# EAGLE design esp32_servo_lcd_cam (EAGLE 9.7.0)
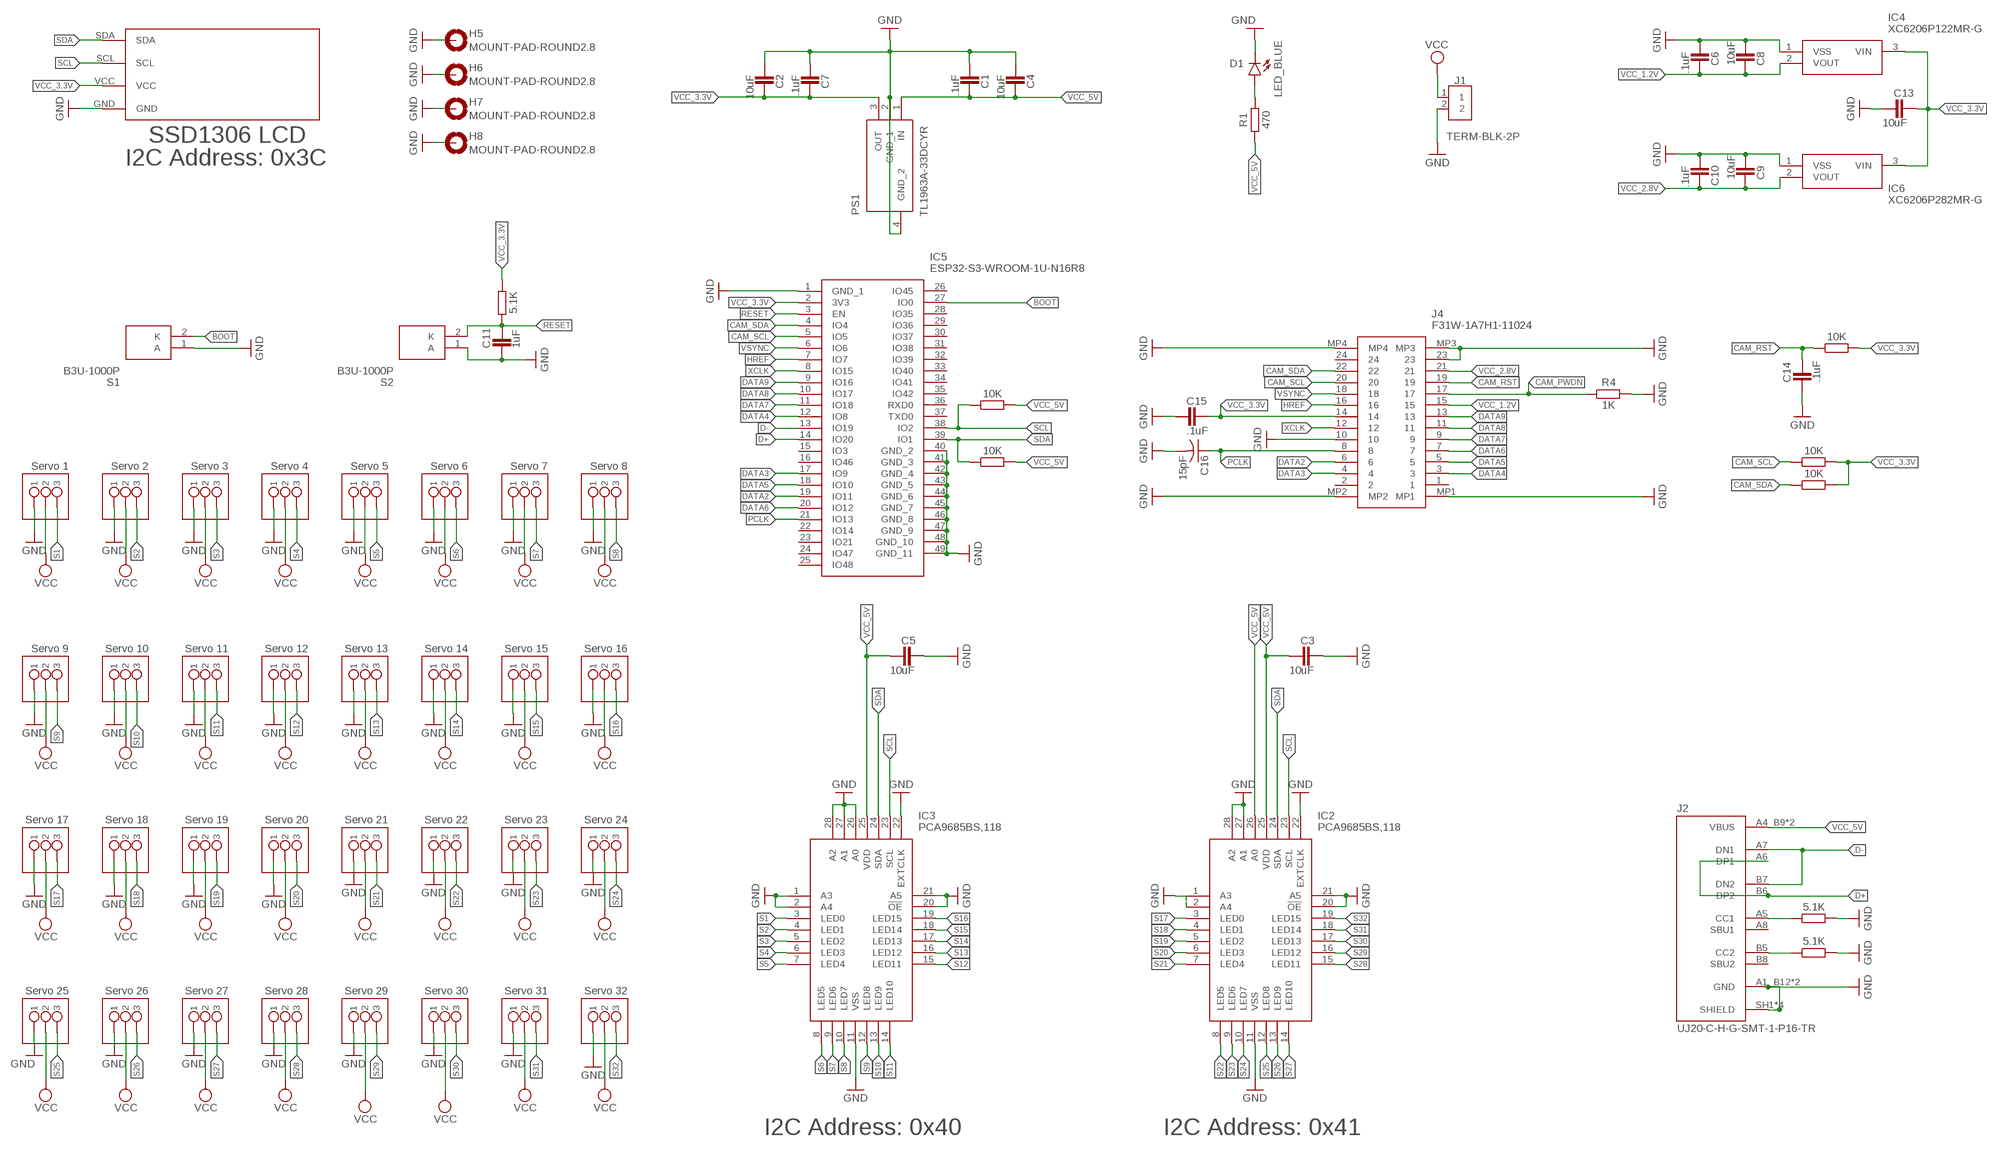
[diagram p0: schematic, sheet 1]

## Parts
C1  .1uF  CAPACITOR_CHIP-0504(1310-METRIC)  [CAPC1110X102]
C2  10uF  CAPACITOR_CHIP-0504(1310-METRIC)  [CAPC1110X102]
C3  10uF  CAPACITOR_CHIP-0504(1310-METRIC)  [CAPC1110X102]
C4  10uF  CAPACITOR_CHIP-0504(1310-METRIC)  [CAPC1110X102]
C5  10uF  CAPACITOR_CHIP-0504(1310-METRIC)  [CAPC1110X102]
C6  .1uF  CAPACITOR_CHIP-0504(1310-METRIC)  [CAPC1110X102]
C7  .1uF  CAPACITOR_CHIP-0504(1310-METRIC)  [CAPC1110X102]
C8  10uF  CAPACITOR_CHIP-0504(1310-METRIC)  [CAPC1110X102]
C9  10uF  CAPACITOR_CHIP-0504(1310-METRIC)  [CAPC1110X102]
C10  .1uF  CAPACITOR_CHIP-0504(1310-METRIC)  [CAPC1110X102]
C11  1uF  CAPACITOR_CHIP-0504(1310-METRIC)  [CAPC1110X102]
C13  10uF  CAPACITOR_CHIP-0504(1310-METRIC)  [CAPC1110X102]
C14  .1uF  CAPACITOR_CHIP-0504(1310-METRIC)  [CAPC1110X102]
C15  .1uF  CAPACITOR_CHIP-0504(1310-METRIC)  [CAPC1110X102]
C16  15pF  C-US_CHIP-0805(2012-METRIC)  [CAPC2012X110]
D1  LED_BLUE  CHIP-FLAT-B_0603-0.80MM  [LEDC1608X80N_FLAT-B]
H5  MOUNT-PAD-ROUND2.8  [2,8-PAD]
H6  MOUNT-PAD-ROUND2.8  [2,8-PAD]
H7  MOUNT-PAD-ROUND2.8  [2,8-PAD]
H8  MOUNT-PAD-ROUND2.8  [2,8-PAD]
IC2  PCA9685BS,118  [QFN65P600X600X100-29N]
IC3  PCA9685BS,118  [QFN65P600X600X100-29N]
IC4  XC6206P122MR-G  [SOT95P280X130-3N]
IC5  ESP32-S3-WROOM-1U-N16R8  [ESP32S3WROOM1UN16R8]
IC6  XC6206P282MR-G  [SOT95P280X130-3N]
J1  TERM-BLK-2P  2828XX-2282837-2  [TERMBLK_508-2N]
J2  UJ20-C-H-G-SMT-1-P16-TR  [SAMESKY_UJ20-C-H-G-SMT-1-P16-TR]
J4  F31W-1A7H1-11024  [F31W1A7H111024]
PS1  TL1963A-33DCYR  [SOT230P700X180-4N]
R1  470  R_CHIP-0402(1005-METRIC)  [RESC1005X40]
R2  5.1K  R_CHIP-0402(1005-METRIC)  [RESC1005X40]
R3  10K  R_CHIP-0402(1005-METRIC)  [RESC1005X40]
R4  1K  R_CHIP-0603(1608-METRIC)  [RESC1608X60]
R5  10K  R_CHIP-0402(1005-METRIC)  [RESC1005X40]
R6  10K  R_CHIP-0402(1005-METRIC)  [RESC1005X40]
R11  5.1K  R_CHIP-0402(1005-METRIC)  [RESC1005X40]
R12  5.1K  R_CHIP-0402(1005-METRIC)  [RESC1005X40]
R23  10K  R_CHIP-0402(1005-METRIC)  [RESC1005X40]
R24  10K  R_CHIP-0402(1005-METRIC)  [RESC1005X40]
S1  B3U-1000P  [B3U-1000P]
S2  B3U-1000P  [B3U-1000P]
U$1  Servo 6  PINHD-1X03_1X03M  [1X03]
U$2  Servo 7  PINHD-1X03_1X03M  [1X03]
U$3  Servo 8  PINHD-1X03_1X03M  [1X03]
U$4  Servo 9  PINHD-1X03_1X03M  [1X03]
U$5  Servo 10  PINHD-1X03_1X03M  [1X03]
U$6  Servo 11  PINHD-1X03_1X03M  [1X03]
U$7  Servo 12  PINHD-1X03_1X03M  [1X03]
U$8  Servo 13  PINHD-1X03_1X03M  [1X03]
U$9  Servo 14  PINHD-1X03_1X03M  [1X03]
U$10  Servo 15  PINHD-1X03_1X03M  [1X03]
U$11  Servo 4  PINHD-1X03_1X03M  [1X03]
U$12  Servo 5  PINHD-1X03_1X03M  [1X03]
U$13  Servo 1  PINHD-1X03_1X03M  [1X03]
U$14  Servo 3  PINHD-1X03_1X03M  [1X03]
U$15  Servo 2  PINHD-1X03_1X03M  [1X03]
U$16  Servo 16  PINHD-1X03_1X03M  [1X03]
U$17  Servo 17  PINHD-1X03_1X03M  [1X03]
U$18  Servo 18  PINHD-1X03_1X03M  [1X03]
U$19  Servo 19  PINHD-1X03_1X03M  [1X03]
U$20  Servo 21  PINHD-1X03_1X03M  [1X03]
U$21  Servo 20  PINHD-1X03_1X03M  [1X03]
U$22  Servo 22  PINHD-1X03_1X03M  [1X03]
U$23  Servo 23  PINHD-1X03_1X03M  [1X03]
U$24  Servo 24  PINHD-1X03_1X03M  [1X03]
U$25  Servo 25  PINHD-1X03_1X03M  [1X03]
U$26  Servo 26  PINHD-1X03_1X03M  [1X03]
U$27  Servo 27  PINHD-1X03_1X03M  [1X03]
U$28  Servo 28  PINHD-1X03_1X03M  [1X03]
U$29  Servo 29  PINHD-1X03_1X03M  [1X03]
U$30  Servo 30  PINHD-1X03_1X03M  [1X03]
U$31  Servo 31  PINHD-1X03_1X03M  [1X03]
U$32  Servo 32  PINHD-1X03_1X03M  [1X03]
U$33  128X32_SSD1306_I2C_LCD  [128X32_SSD1306_I2C_LCD_]

## Nets
BOOT: IC5.27(IO0) S1.2(K)
CAM_PWDN: J4.17 R4.1
CAM_RST: C14.1 J4.19 R3.1
CAM_SCL: IC5.5(IO5) J4.20 R5.1
CAM_SDA: IC5.4(IO4) J4.22 R6.1
D+: IC5.14(IO20) J2.A6(DP1) J2.B6(DP2)
D-: IC5.13(IO19) J2.A7(DN1) J2.B7(DN2)
DATA2: IC5.19(IO11) J4.6
DATA3: IC5.17(IO9) J4.4
DATA4: IC5.12(IO8) J4.3
DATA5: IC5.18(IO10) J4.5
DATA6: IC5.20(IO12) J4.7
DATA7: IC5.11(IO18) J4.9
DATA8: IC5.10(IO17) J4.11
DATA9: IC5.9(IO16) J4.13
GND: C1.2 C2.2 C3.1 C4.2 C5.1 C6.2 C7.2 C8.2 C9.2 C10.2 C11.2 C13.2 C14.2 C15.2 C16.2 D1.C H5.B2,8(MOUNT) H6.B2,8(MOUNT) H7.B2,8(MOUNT) H8.B2,8(MOUNT) IC2.11(VSS) IC2.20(!OE) IC2.21(A5) IC2.27(A1) IC2.28(A2) IC3.1(A3) IC3.2(A4) IC3.11(VSS) IC3.20(!OE) IC3.21(A5) IC3.22(EXTCLK) IC3.26(A0) IC3.27(A1) IC3.28(A2) IC4.1(VSS) IC5.1(GND_1) IC5.40(GND_2) IC5.41(GND_3) IC5.42(GND_4) IC5.43(GND_5) IC5.44(GND_6) IC5.45(GND_7) IC5.46(GND_8) IC5.47(GND_9) IC5.48(GND_10) IC5.49(GND_11) IC6.1(VSS) J1.2 J2.A1_B12(GND) J2.B1_A12(GND) J2.SH1(SHIELD) J2.SH2(SHIELD) J2.SH3(SHIELD) J2.SH4(SHIELD) J4.10 J4.23 J4.MP1 J4.MP2 J4.MP3 J4.MP4 PS1.2(GND_1) PS1.4(GND_2) R4.2 R11.2 R12.2 S1.1(A) S2.1(A) U$1.1 U$2.1 U$3.1 U$4.1 U$5.1 U$6.1 U$7.1 U$8.1 U$9.1 U$10.1 U$11.1 U$12.1 U$13.1 U$14.1 U$15.1 U$16.1 U$17.1 U$18.1 U$19.1 U$20.1 U$21.1 U$22.1 U$23.1 U$24.1 U$25.1 U$26.1 U$27.1 U$28.1 U$29.1 U$30.1 U$31.1 U$32.1 U$33.GND
HREF: IC5.7(IO7) J4.16
N$1: D1.A R1.2
N$2: J2.A5(CC1) R12.1
N$3: J2.B5(CC2) R11.1
N$4: IC2.2(A4)
N$5: IC2.22(EXTCLK) ; supply symbol labelled GND
N$7: IC2.1(A3) ; supply symbol labelled GND
PCLK: C16.1 IC5.21(IO13) J4.8
RESET: C11.1 IC5.3(EN) R2.2 S2.2(K)
S1: IC3.3(LED0) U$13.3
S2: IC3.4(LED1) U$15.3
S3: IC3.5(LED2) U$14.3
S4: IC3.6(LED3) U$11.3
S5: IC3.7(LED4) U$12.3
S6: IC3.8(LED5) U$1.3
S7: IC3.9(LED6) U$2.3
S8: IC3.10(LED7) U$3.3
S9: IC3.12(LED8) U$4.3
S10: IC3.13(LED9) U$5.3
S11: IC3.14(LED10) U$6.3
S12: IC3.15(LED11) U$7.3
S13: IC3.16(LED12) U$8.3
S14: IC3.17(LED13) U$9.3
S15: IC3.18(LED14) U$10.3
S16: IC3.19(LED15) U$16.3
S17: IC2.3(LED0) U$17.3
S18: IC2.4(LED1) U$18.3
S19: IC2.5(LED2) U$19.3
S20: IC2.6(LED3) U$21.3
S21: IC2.7(LED4) U$20.3
S22: IC2.8(LED5) U$22.3
S23: IC2.9(LED6) U$23.3
S24: IC2.10(LED7) U$24.3
S25: IC2.12(LED8) U$25.3
S26: IC2.13(LED9) U$26.3
S27: IC2.14(LED10) U$27.3
S28: IC2.15(LED11) U$28.3
S29: IC2.16(LED12) U$29.3
S30: IC2.17(LED13) U$30.3
S31: IC2.18(LED14) U$31.3
S32: IC2.19(LED15) U$32.3
SCL: IC2.23(SCL) IC3.23(SCL) IC5.38(IO2) R23.1 U$33.SCL
SDA: IC2.24(SDA) IC3.24(SDA) IC5.39(IO1) R24.1 U$33.SDA
VCC: J1.1 U$1.2 U$2.2 U$3.2 U$4.2 U$5.2 U$6.2 U$7.2 U$8.2 U$9.2 U$10.2 U$11.2 U$12.2 U$13.2 U$14.2 U$15.2 U$16.2 U$17.2 U$18.2 U$19.2 U$20.2 U$21.2 U$22.2 U$23.2 U$24.2 U$25.2 U$26.2 U$27.2 U$28.2 U$29.2 U$30.2 U$31.2 U$32.2
VCC_1.2V: C6.1 C8.1 IC4.2(VOUT) J4.15
VCC_2.8V: C9.1 C10.1 IC6.2(VOUT) J4.21
VCC_3.3V: C2.1 C7.1 C13.1 C15.1 IC4.3(VIN) IC5.2(3V3) IC6.3(VIN) J4.14 PS1.3(OUT) R2.1 R3.2 R5.2 R6.2 U$33.VCC
VCC_5V: C1.1 C3.2 C4.1 C5.2 IC2.25(VDD) IC2.26(A0) IC3.25(VDD) J2.A4_B9(VBUS) J2.B4_A9(VBUS) PS1.1(IN) R1.1 R23.2 R24.2
VSYNC: IC5.6(IO6) J4.18
XCLK: IC5.8(IO15) J4.12
Unconnected: IC5.15(IO3) IC5.16(IO46) IC5.22(IO14) IC5.23(IO21) IC5.24(IO47) IC5.25(IO48) IC5.26(IO45) IC5.28(IO35) IC5.29(IO36) IC5.30(IO37) IC5.31(IO38) IC5.32(IO39) IC5.33(IO40) IC5.34(IO41) IC5.35(IO42) IC5.36(RXD0) IC5.37(TXD0) J2.A8(SBU1) J2.B8(SBU2) J4.1 J4.2 J4.24

## Notes on the sheet
- SSD1306 LCD
- I2C Address: 0x3C
- I2C Address: 0x40 | I2C Address: 0x41

## Library data of the parts
C1-C11 C13-C15 = Tinkercad:CAPACITOR: Capacitor - Generic; CATEGORY: Capacitor
C16 = Capacitor:C-US: Capacitor - ANSI; CATEGORY: Capacitor
D1 = LED:CHIP-FLAT-B; CATEGORY: LED; COLOR: BLUE; DESCRIPTION: CHIP LED FLAT; SUB-CATEGORY: CHIP; TYPE: FLAT_TOP
H5-H8 = holes:MOUNT-PAD-ROUND: MOUNTING PAD, round
IC2 IC3 = PCA9685BS_118:PCA9685BS,118: NXP - PCA9685BS,118 - LED Driver, 16 Bit, I2C Bus, 12-bit PWM 24 Hz to 1526 Hz, RGBA color, 2.3 V to 5.5 V in, HVQFN-28 Source: Datasheet <http://www.nxp.com/docs/en/data-sheet/PCA9685.pdf>; DESCRIPTION: NXP - PCA9685BS,118 - LED Driver, 16 Bit, I2C Bus, 12-bit PWM 24 Hz to 1526 Hz, RGBA color, 2.3 V to 5.5 V in, HVQFN-28; HEIGHT: 1mm; MANUFACTURER_NAME: NXP; MANUFACTURER_PART_NUMBER: PCA9685BS,118; MOUSER_PART_NUMBER: 771-PCA9685BS118; MOUSER_PRICE-STOCK: https://www.mouser.co.uk/ProductDetail/NXP-Semiconductors/PCA9685BS118?qs=beN0Cyoe8Yle51zseU5uxw%3D%3D
IC4 = XC6206P122MR-G:XC6206P122MR-G: LDO Voltage Regulators 1uA Low Quiescent 3 Terminal, Low ESR Cap. Compatible, Voltage Regulator Source: Datasheet <https://www.torexsemi.com/file/xc6206/XC6206.pdf>; DESCRIPTION: LDO Voltage Regulators 1uA Low Quiescent 3 Terminal, Low ESR Cap. Compatible, Voltage Regulator; HEIGHT: 1.3mm; MANUFACTURER_NAME: Torex; MANUFACTURER_PART_NUMBER: XC6206P122MR-G; MOUSER_PART_NUMBER: 865-XC6206P122MR-G; MOUSER_PRICE-STOCK: https://www.mouser.co.uk/ProductDetail/Torex-Semiconductor/XC6206P122MR-G?qs=AsjdqWjXhJ%2F35%2FU%2FZk2JYg%3D%3D
IC5 = ESP32-S3-WROOM-1U-N16R8:ESP32-S3-WROOM-1U-N16R8: WiFi Modules - 802.11 [Engineering Samples] SMD Module, ESP32-S3R8, 8 MB Octal PSRAM Die, 16 MB Quad SPI Flash, IPEX Antenna Connector Source: Datasheet <https://www.espressif.com/sites/default/files/documentation/esp32-s3-wroom-1_wroom-1u_datasheet_en.pdf>; DESCRIPTION: WiFi Modules - 802.11 [Engineering Samples] SMD Module, ESP32-S3R8, 8 MB Octal PSRAM Die, 16 MB Quad SPI Flash, IPEX Antenna Connector; HEIGHT: 3.35mm; MANUFACTURER_NAME: Espressif Systems; MANUFACTURER_PART_NUMBER: ESP32-S3-WROOM-1U-N16R8; MOUSER_PART_NUMBER: 356-ESP32S3WM1UN16R8; MOUSER_PRICE-STOCK: https://www.mouser.co.uk/ProductDetail/Espressif-Systems/ESP32-S3-WROOM-1U-N16R8?qs=Li%252BoUPsLEns6V0Pr5KRJtw%3D%3D
IC6 = XC6206P282MR-G:XC6206P282MR-G: LDO Voltage Regulators 1uA Low Quiescent 3 Terminal, Low ESR Cap. Compatible, Voltage Regulator Source: Datasheet <https://www.torexsemi.com/file/xc6206/XC6206.pdf>; DESCRIPTION: LDO Voltage Regulators 1uA Low Quiescent 3 Terminal, Low ESR Cap. Compatible, Voltage Regulator; HEIGHT: 1.3mm; MANUFACTURER_NAME: Torex; MANUFACTURER_PART_NUMBER: XC6206P282MR-G; MOUSER_PART_NUMBER: 865-XC6206P282MR-G; MOUSER_PRICE-STOCK: https://www.mouser.co.uk/ProductDetail/Torex-Semiconductor/XC6206P282MR-G?qs=AsjdqWjXhJ%2Fpd3DOBopSeA%3D%3D
J1 = Connector:2828XX-2: 2 Position Wire to Board Terminal Block Horizontal with Board Datasheet <https://www.te.com.cn/commerce/DocumentDelivery/DDEController?Action=showdoc&DocId=Catalog+Section%7F1308389_EUROSTYLE_TERMINAL_BLOCKS%7F0607%7Fpdf%7FEnglish%7FENG_CS_1308389_EUROSTYLE_TERMINAL_BLOCKS_0607.pdf%7F2-282837-5>; CATEGORY: Fixed Terminal Blocks; DESCRIPTION: Fixed Terminal Blocks 5.08MM PCB MOUNT 2P; MANUFACTURER: TE Connectivity AMP Connectors; MPN: 282837-2; OPERATING_TEMPERATURE: -40°C to +105°C; PART_STATUS: ACTIVE; PITCH: 0.200" (5.08mm); ROHS_COMPLIANCE: RoHS Compliant; SERIES: Buchanan; SUBCATEGORY: Terminal Blocks; TYPE: Through Hole; Screw - Rising Cage Clamp; Side wire entry, Horizontal with Board
J2 = UJ20-C-H-G-SMT-1-P16-TR:UJ20-C-H-G-SMT-1-P16-TR; MANUFACTURER: Same Sky; MAXIMUM_PACKAGE_HEIGHT: 3.46mm; PARTREV: 1.0; STANDARD: Manufacturer Recommendations
J4 = F31W-1A7H1-11024:F31W-1A7H1-11024: Flex Connector, 0.50mm Pitch, Height 4.25mm, Vertical, Slider type, ZIF, 24 position, Without MYLAR Source: Datasheet <https://cdn.amphenol-cs.com/media/wysiwyg/files/documentation/datasheet/flex/ffc_fpc_050mm_f31w_f31z_f314_f336.pdf>; DESCRIPTION: Flex Connector, 0.50mm Pitch, Height 4.25mm, Vertical, Slider type, ZIF, 24 position, Without MYLAR; HEIGHT: 4.45mm; MANUFACTURER_NAME: Amphenol; MANUFACTURER_PART_NUMBER: F31W-1A7H1-11024; MOUSER_PART_NUMBER: 649-F31W-1A7H1-11024; MOUSER_PRICE-STOCK: https://www.mouser.co.uk/ProductDetail/Amphenol-Aorora/F31W-1A7H1-11024?qs=xZ%2FP%252Ba9zWqa0iq%252BjDeduug%3D%3D
PS1 = TL1963A-33DCYR:TL1963A-33DCYR: 1.5-A Low-Noise Fast-Transient-Response Low-Dropout Regulator Source: Datasheet <http://www.ti.com/lit/gpn/tl1963a>; DESCRIPTION: 1.5-A Low-Noise Fast-Transient-Response Low-Dropout Regulator; HEIGHT: 1.8mm; MANUFACTURER_NAME: Texas Instruments; MANUFACTURER_PART_NUMBER: TL1963A-33DCYR; MOUSER_PART_NUMBER: 595-TL1963A-33DCYR; MOUSER_PRICE-STOCK: https://www.mouser.co.uk/ProductDetail/Texas-Instruments/TL1963A-33DCYR?qs=IK5e5L0zOXhRu%2FNTAfJNEA%3D%3D
R1-R6 R11 R12 R23 R24 = Resistor:R: Resistor Fixed - Generic; CATEGORY: Resistor; SUB-CATEGORY: Fixed
S1 S2 = B3U-1000P:B3U-1000P: OMRON ELECTRONIC COMPONENTS - B3U-1000P - SWITCH, SPST-NO, 0.05A, 12V, SMD Source: Datasheet <https://www.omron.com/ecb/products/pdf/en-b3u.pdf>; DESCRIPTION: OMRON ELECTRONIC COMPONENTS - B3U-1000P - SWITCH, SPST-NO, 0.05A, 12V, SMD; HEIGHT: mm; MANUFACTURER_NAME: OMRON Electronics; MANUFACTURER_PART_NUMBER: B3U-1000P; MOUSER_PART_NUMBER: 653-B3U-1000P; MOUSER_PRICE-STOCK: https://www.mouser.co.uk/ProductDetail/Omron-Electronics/B3U-1000P?qs=AO7BQMcsEu4ip80xyf2FwA%3D%3D
U$1-U$32 = Tinkercad:PINHD-1X03
U$33 = 128X32_SSD1306_I2C_LCD:128X32_SSD1306_I2C_LCD: 128 x 32 SSD1306 I2C LCD

## Board
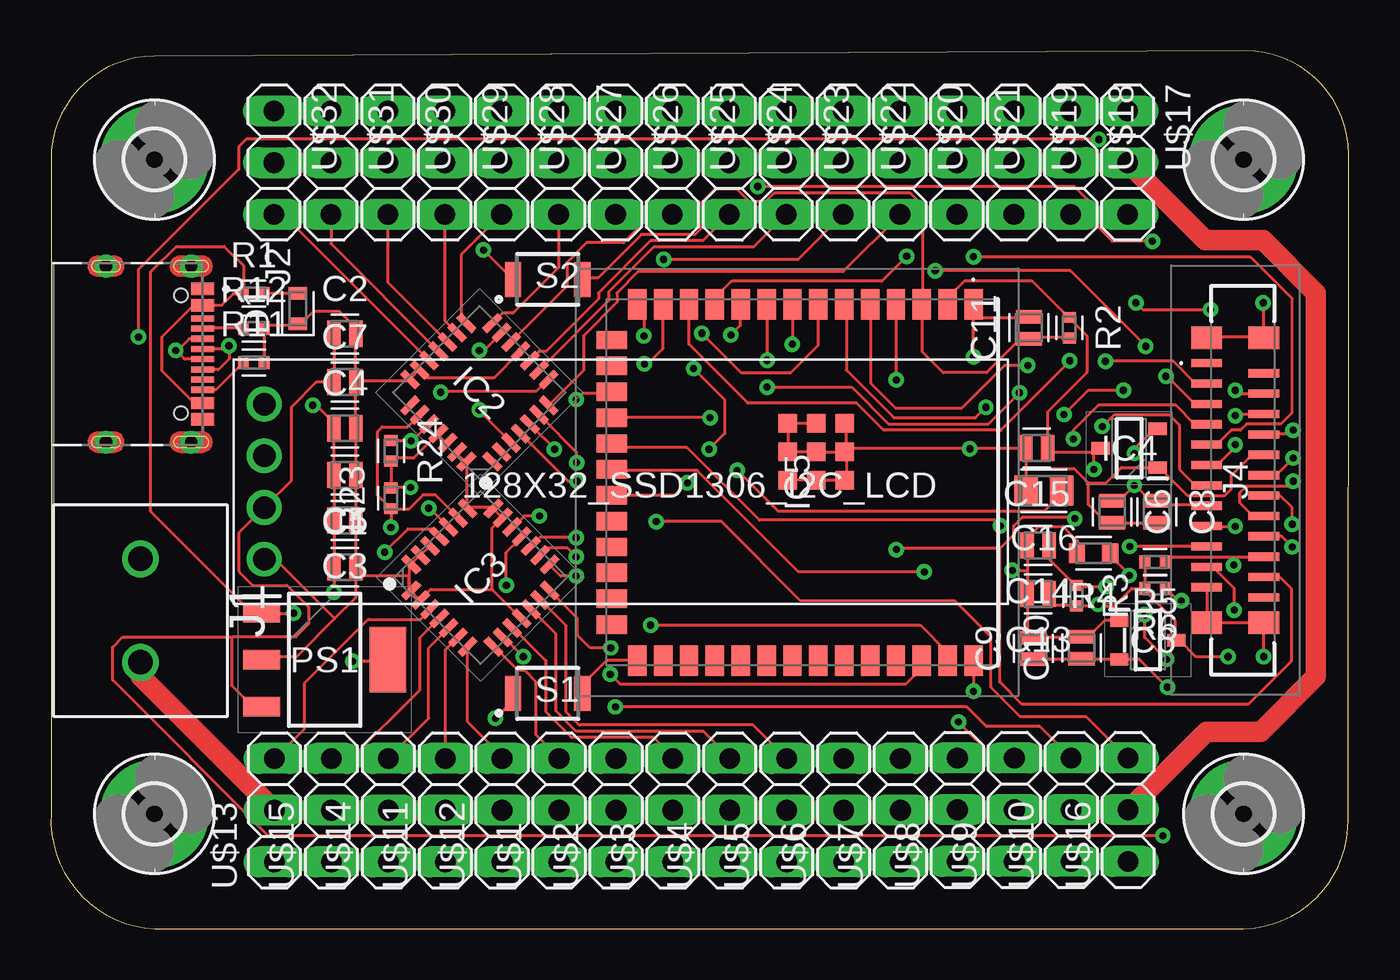
[diagram p1: board, top side]
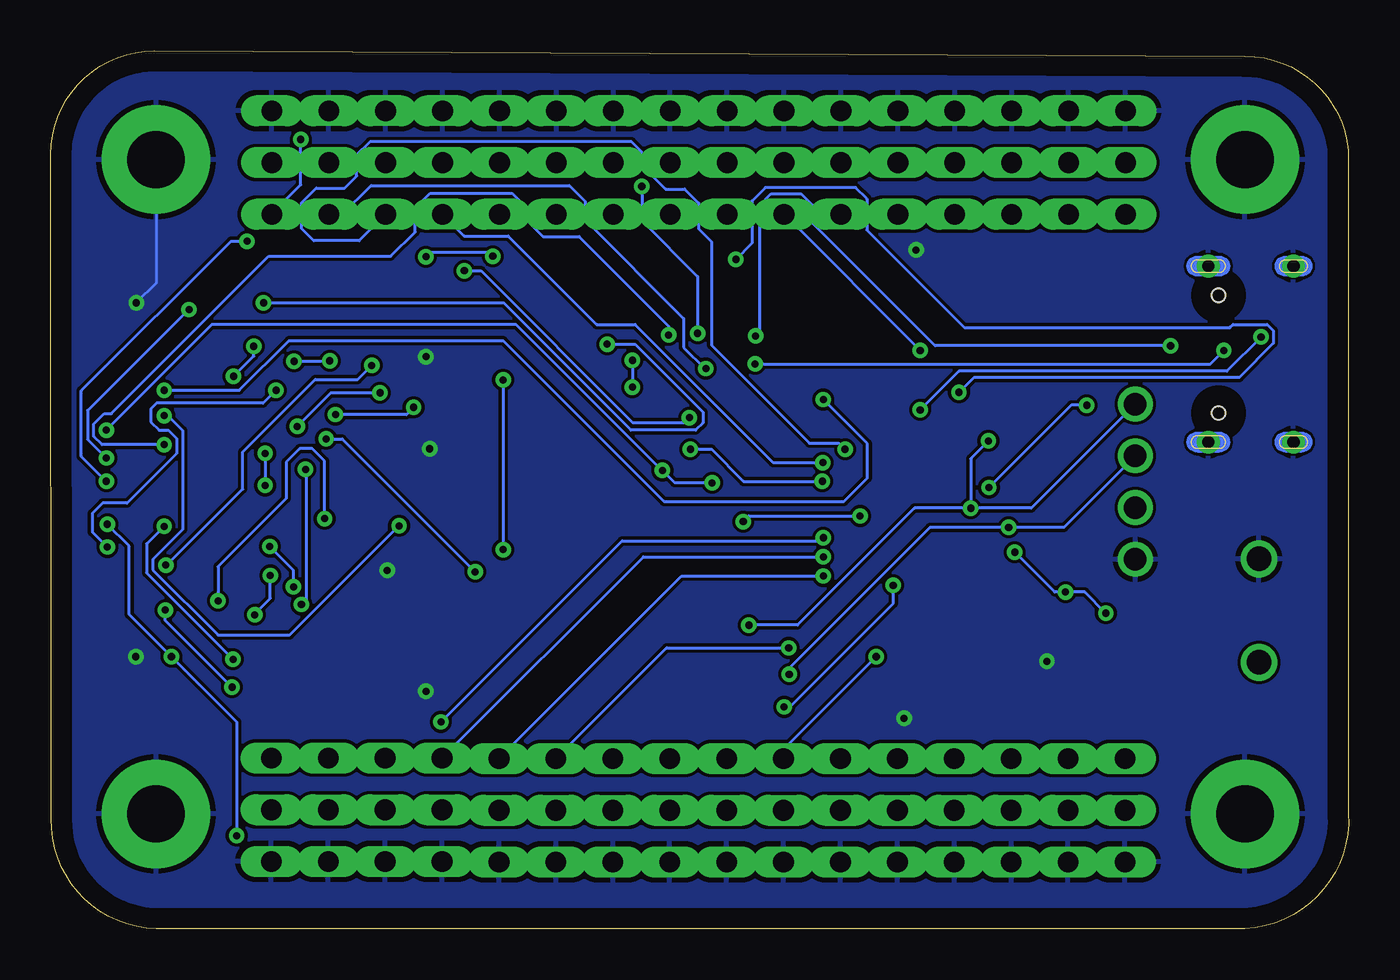
[diagram p2: board, bottom side, seen from below]

Size 63.71 x 43.1 mm. Coordinates in mm from the lower left corner, seen from the top.
Outline: 0,37.77 0,5.64 arc90 5.08,0 58.55,0 arc90 63.68,5.41 63.71,38.02 arc90 58.63,43.1 5.08,42.85 arc90 0,37.77
Copper layers (1*16): Top 0.035mm / dielectric 1.5mm / Bottom 0.035mm
Design rules "Fusion Electronics Design Rules *": minimum track width 6mil, minimum drill 0.35mm, track to track 6mil, track to pad 6mil, pad to pad 6mil, via to via 6mil, smd to smd 6mil, copper to edge 40mil, drill to drill 6mil, minimum pad ring 10mil, minimum via ring 8mil, stop-mask expansion 4mil, vias tented up to drill 9999mil, thermal gap 10mil

### Footprints (pad centres in the part's own frame; a part is rotated, then mirrored left to right if it is on the bottom)
CAPC1110X102 = smd 0.663 x 1.282: 1 -0.539,0; 2 0.539,0
CAPC2012X110 = smd 1.165 x 1.465: 1 -0.875,0; 2 0.875,0
LEDC1608X80N_FLAT-B = smd 0.612 x 0.912: A 0.75,0; C -0.75,0
2,8-PAD = drill 2.8 pad 5.334: B2,8 0,0
QFN65P600X600X100-29N = smd 1.05 x 0.35: 1 -2.85,1.95; 2 -2.85,1.3; 3 -2.85,0.65; 4 -2.85,0; 5 -2.85,-0.65; 6 -2.85,-1.3; 7 -2.85,-1.95; 15 2.85,-1.95; 16 2.85,-1.3; 17 2.85,-0.65; 18 2.85,0; 19 2.85,0.65; 20 2.85,1.3; 21 2.85,1.95 | smd 0.35 x 1.05: 8 -1.95,-2.85; 9 -1.3,-2.85; 10 -0.65,-2.85; 11 0,-2.85; 12 0.65,-2.85; 13 1.3,-2.85; 14 1.95,-2.85; 22 1.95,2.85; 23 1.3,2.85; 24 0.65,2.85; 25 0,2.85; 26 -0.65,2.85; 27 -1.3,2.85; 28 -1.95,2.85
SOT95P280X130-3N = smd 0.9 x 0.6: 1 -1.4,0.95; 2 -1.4,-0.95; 3 1.4,0
ESP32S3WROOM1UN16R8 = smd 1.5 x 0.9: 1 -8.75,8.41; 2 -8.75,7.14; 3 -8.75,5.87; 4 -8.75,4.6; 5 -8.75,3.33; 6 -8.75,2.06; 7 -8.75,0.79; 8 -8.75,-0.48; 9 -8.75,-1.75; 10 -8.75,-3.02; 11 -8.75,-4.29; 12 -8.75,-5.56; 13 -8.75,-6.83; 14 -8.75,-8.1; 27 8.75,-8.1; 28 8.75,-6.83; 29 8.75,-5.56; 30 8.75,-4.29; 31 8.75,-3.02; 32 8.75,-1.75; 33 8.75,-0.48; 34 8.75,0.79; 35 8.75,2.06; 36 8.75,3.33; 37 8.75,4.6; 38 8.75,5.87; 39 8.75,7.14; 40 8.75,8.41 | smd 0.9 x 1.5: 15 -6.985,-9.35; 16 -5.715,-9.35; 17 -4.445,-9.35; 18 -3.175,-9.35; 19 -1.905,-9.35; 20 -0.635,-9.35; 21 0.635,-9.35; 22 1.905,-9.35; 23 3.175,-9.35; 24 4.445,-9.35; 25 5.715,-9.35; 26 6.985,-9.35 | smd 0.9 x 0.9: 41 -1.5,0.69; 42 -1.5,2.09; 43 -2.9,2.09; 44 -2.9,0.69; 45 -2.9,-0.71; 46 -1.5,-0.71; 47 -0.1,-0.71; 48 -0.1,0.69; 49 -0.1,2.09
TERMBLK_508-2N = drill 1.2: 1 0,0; 2 5.08,0
SAMESKY_UJ20-C-H-G-SMT-1-P16-TR = smd 0.6 x 1.15: A1_B12 -3.2,7.345; A4_B9 -2.4,7.345; B1_A12 3.2,7.345; B4_A9 2.4,7.345 | smd 0.3 x 1.15: A5 -1.25,7.345; A6 -0.25,7.345; A7 0.25,7.345; A8 1.25,7.345; B5 1.75,7.345; B6 0.75,7.345; B7 -0.75,7.345; B8 -1.75,7.345 | drill 0.6 pad 1: SH1 -4.32,6.78; SH2 4.32,6.78; SH3 -4.32,2.6; SH4 4.32,2.6 | hole 0.65: -2.89,6.28; 2.89,6.28
F31W1A7H111024 = smd 0.4 x 1.5: 1 5.75,1.4; 2 5.25,-1.4; 3 4.75,1.4; 4 4.25,-1.4; 5 3.75,1.4; 6 3.25,-1.4; 7 2.75,1.4; 8 2.25,-1.4; 9 1.75,1.4; 10 1.25,-1.4; 11 0.75,1.4; 12 0.25,-1.4; 13 -0.25,1.4; 14 -0.75,-1.4; 15 -1.25,1.4; 16 -1.75,-1.4; 17 -2.25,1.4; 18 -2.75,-1.4; 19 -3.25,1.4; 20 -3.75,-1.4; 21 -4.25,1.4; 22 -4.75,-1.4; 23 -5.25,1.4; 24 -5.75,-1.4 | smd 1.1 x 1.5: MP1 7,1.4; MP2 7,-1.4; MP3 -7,1.4; MP4 -7,-1.4
SOT230P700X180-4N = smd 1.8 x 0.95: 1 -3.1,2.3; 2 -3.1,0; 3 -3.1,-2.3 | smd 1.8 x 3.2: 4 3.1,0
RESC1005X40 = smd 0.535 x 0.644: 1 -0.507,0; 2 0.507,0
RESC1608X60 = smd 0.799 x 0.974: 1 -0.815,0; 2 0.815,0
B3U-1000P = smd 0.8 x 1.7: 1 1.7,0; 2 -1.7,0
1X03 = drill 1.016 long: 1 -2.54,0; 2 0,0; 3 2.54,0
128X32_SSD1306_I2C_LCD_ = drill 1.105 pad 1.705: GND 1.5,2.19; SCL 1.5,7.27; SDA 1.5,9.81; VCC 1.5,4.73

### Placement (x,y rotation side)
C1  14.43,17.75 0 top
C2  14.43,29.21 0 top
C3  14.43,20.05 180 top
C4  14.43,24.58 0 top
C5  14.43,22.29 180 top
C6  52.1,20.47 270 top
C7  14.43,26.84 0 top
C8  54.28,20.47 270 top
C9  48.24,13.77 90 top
C10  50.6,13.79 90 top
C11  48.01,29.51 90 top
C13  48.47,16.43 180 top
C14  48.47,18.82 180 top
C15  48.39,23.6 180 top
C16  48.75,21.51 180 top
D1  12.13,30.45 90 top
H5  5.08,5.64 0 top
H6  5.08,37.77 0 top
H7  58.55,37.77 0 top
H8  58.55,5.64 0 top
IC2  21.03,26.34 135 top
IC3  21.08,17.25 45 top
IC4  52.94,23.6 180 top
IC5  36.88,21.92 270 top
IC6  53.85,14.17 0 top
J1  4.4,13.08 90 top
J2  0.1,28.22 270 top
J4  58.14,22.02 90 top
PS1  13.44,13.21 0 top
R1  9.96,31.19 0 top
R2  49.99,29.51 270 top
R3  50.35,16.36 270 top
R4  51.18,18.44 180 top
R5  54.21,18.01 180 top
R6  54.21,16.71 180 top
R11  9.96,27.8 0 top
R12  9.96,29.48 0 top
R23  16.69,21.13 90 top
R24  16.69,23.47 270 top
S1  24.39,11.56 180 top
S2  24.39,31.88 180 top
U$1  24.95,5.82 90 top
U$2  27.74,5.82 90 top
U$3  30.53,5.82 90 top
U$4  33.33,5.82 90 top
U$5  36.12,5.82 90 top
U$6  38.92,5.82 90 top
U$7  41.71,5.82 90 top
U$8  44.5,5.84 90 top
U$9  47.3,5.84 90 top
U$10  50.09,5.84 90 top
U$11  19.36,5.82 90 top
U$12  22.15,5.82 90 top
U$13  10.98,5.82 90 top
U$14  16.56,5.82 90 top
U$15  13.77,5.82 90 top
U$16  52.89,5.84 90 top
U$17  52.86,37.62 270 top
U$18  50.07,37.62 270 top
U$19  47.27,37.62 270 top
U$20  41.68,37.62 270 top
U$21  44.48,37.62 270 top
U$22  38.89,37.62 270 top
U$23  36.1,37.62 270 top
U$24  33.3,37.62 270 top
U$25  30.51,37.62 270 top
U$26  27.71,37.62 270 top
U$27  24.92,37.62 270 top
U$28  22.13,37.62 270 top
U$29  19.33,37.62 270 top
U$30  16.54,37.62 270 top
U$31  13.74,37.62 270 top
U$32  10.95,37.62 270 top
U$33  8.97,15.95 0 top

### Tracks (layer width: path | path; a pad name or v marks a point on that pad's centre or on a via)
BOOT
  Top 0.152: IC5.27 28.77,13.18 27.28,13.18 26.09,11.99 S1.2
CAM_PWDN  (via drill 0.35)
  Top 0.152: R4.1 52,18.34 52.94,17.4 v52.94,17.35 | v53.7,15.42 53.7,14.3 v54.76,13.23 | v58.14,19.76 57.3,19.76 57.29,19.77 J4.17
  Bottom 0.152: v53.7,15.42 53.7,15.47 52.94,16.23 v52.94,17.35 | v54.76,13.23 59.01,17.47 59.01,18.9 v58.14,19.76
CAM_RST  (via drill 0.35)
  Top 0.152: C14.1 48.95,18.75 48.95,18.21 50.29,16.87 50.33,16.88 R3.1 50.42,16.79 v51.79,16.79 | J4.19 v52.96,18.77
  Bottom 0.152: v52.96,18.77 51.79,17.6 v51.79,16.79
CAM_SCL  (via drill 0.35)
  Top 0.152: 58.07,18.24 59.46,18.24 J4.20 | 58.07,18.24 54.97,18.24 54.82,18.08 54.73,18.08 R5.1 | v47.96,27.66 46.81,27.66 44.71,25.55 41.48,25.55 40.26,26.77 40.26,30.58 IC5.5 | 58.07,18.24 v58.07,17.86
  Bottom 0.152: v47.96,27.66 48.64,26.97 50.73,26.97 54.28,23.42 54.28,21.59 58.02,17.86 v58.07,17.86
CAM_SDA  (via drill 0.35)
  Top 0.152: 46.59,18.67 46.59,12.12 47.68,11.02 58.78,11.02 60.89,13.13 60.89,16.71 60.33,17.27 J4.22 | J4.22 | v41.51,26.95 41.51,30.66 IC5.4 | 46.59,18.67 41.56,18.67 v41.51,18.62 | 46.59,18.67 47.27,19.35 47.27,19.79 47.68,20.19 50.27,20.19 v50.27,20.14 | v55.5,16.1 55.35,16.1 54.74,16.71 R6.1
  Bottom 0.152: v41.51,26.95 v41.51,18.62 | v55.5,16.1 55.5,17.78 52.15,21.13 52.15,22.91 51.49,23.57 50.88,23.57 50.27,22.96 v50.27,20.14
D+  (via drill 0.35)
  Top 0.152: J2.B6 7.46,27.46 8.23,27.46 8.74,27.97 8.74,28.52 | J2.A6 8.69,28.47 8.74,28.52 | v8.74,28.63 8.74,28.52 | v29.11,29.11 29.11,30.07 IC5.14
  Bottom 0.152: v8.74,28.63 20.3,28.63 26.29,34.62 26.29,35.51 26.88,36.09 28.35,36.09 28.91,35.53 28.91,29.31 v29.11,29.11
D-  (via drill 0.35)
  Top 0.152: J2.A7 6.56,27.97 v6.12,28.4 6.23,28.4 6.78,28.96 7.43,28.96 J2.B7 | v29.14,27.74 29.29,27.74 30.05,28.5 30.05,30.58 IC5.13
  Bottom 0.152: v29.14,27.74 6.78,27.74 v6.12,28.4
DATA2  (via drill 0.35)
  Top 0.152: v46.61,19.79 46.33,20.07 34.78,20.07 31.22,23.62 27.69,23.62 IC5.19 | v58.14,25.2 58.19,25.25 59.46,25.25 J4.6
  Bottom 0.152: v46.61,19.79 46.64,19.79 52,14.43 55.5,14.43 58.7,17.63 58.7,18.14 57.23,19.61 57.23,24.46 57.97,25.2 v58.14,25.2
DATA3  (via drill 0.35)
  Top 0.152: v25.78,25.98 26.11,26.31 27.46,26.31 IC5.17 | J4.4 59.53,26.26 58.32,26.26 v58.14,26.44
  Bottom 0.152: v25.78,25.98 23.62,23.82 23.62,22.12 24.77,20.98 33.61,20.98 41.51,28.88 52.02,28.88 54.46,26.44 v58.14,26.44
DATA4  (via drill 0.35)
  Top 0.152: v50.02,27.89 50.02,27.86 46.64,24.49 40.87,24.49 39.55,25.81 34.22,25.81 31.32,28.7 IC5.12 | v51.77,27.86 55.1,27.86 56.19,26.77 J4.3
  Bottom 0.152: v51.77,27.86 50.04,27.86 v50.02,27.89
DATA5  (via drill 0.35)
  Top 0.152: v32.36,25.09 IC5.18 | v43.41,32.31 50.04,32.31 v53.75,28.6 | v54.74,27.13 54.79,27.13 56.06,25.86 56.72,25.86 J4.5
  Bottom 0.152: v32.36,25.09 32.59,24.87 35.16,24.87 42.6,32.31 v43.41,32.31 | v54.74,27.13 53.75,28.12 v53.75,28.6
DATA6  (via drill 0.35)
  Top 0.152: v42.88,17.53 36.71,17.53 31.73,22.5 27.61,22.5 IC5.20 | v50.19,24.05 50.19,24.49 51.41,25.7 55.22,25.7 56.14,24.79 56.72,24.79 J4.7
  Bottom 0.152: v50.19,24.05 49.41,24.05 v42.88,17.53
DATA7  (via drill 0.35)
  Top 0.152: v45.29,32.99 58.88,32.99 60.91,30.96 60.91,25.32 60.38,24.79 58.7,24.79 58.4,24.49 57.94,24.49 57.33,23.88 56.87,23.88 J4.9 | v42.01,33.02 40.79,31.8 33.4,31.8 32.64,31.04 32.64,30.73 IC5.11
  Bottom 0.152: v45.29,32.99 45.06,33.22 42.22,33.22 v42.01,33.02
DATA8  (via drill 0.35)
  Top 0.152: v33.38,29.16 33.86,29.64 33.86,30.58 IC5.10 | v58.14,23.77 58.14,23.65 57.3,22.81 56.87,22.81 J4.11
  Bottom 0.152: v33.38,29.16 33.38,29.59 37.77,33.98 39.55,33.98 40.41,34.85 40.41,35.46 41.07,36.12 45.09,36.12 45.82,35.38 45.82,34.21 47.02,33.02 53.01,33.02 60.73,25.3 61.09,25.3 61.6,24.79 61.6,24.18 61.19,23.77 v58.14,23.77
DATA9  (via drill 0.35)
  Top 0.152: v51.62,24.66 52.2,25.25 54.89,25.25 55.4,24.74 55.4,22.55 56.06,21.89 56.72,21.89 J4.13 | v47.55,26.31 46.03,24.79 41.13,24.79 39.32,26.59 v35.16,26.59 | v35.16,27.91 35.16,30.65 IC5.9
  Bottom 0.152: v51.62,24.66 49.96,26.31 v47.55,26.31 | v35.16,27.91 v35.16,26.59
GND  (via drill 0.35)
  Top 0.152: IC2.27 19.99,23.27 20.3,22.96 IC2.28 20.4,20.65 IC3.22 20.45,20.68 21.67,20.68 IC3.21 21.82,20.52 22.13,20.22 IC3.20 22.16,20.18 21.67,19.68 21.67,16.66 | IC3.26 IC3.27 18.01,18.24 17.71,17.93 IC3.28 17.58,17.77 17.58,16.72 IC3.1 | IC3.1 17.71,16.56 18.01,16.26 IC3.2 18.15,16.17 18.65,16.66 21.67,16.66 | 21.67,16.66 22.99,15.34 23.04,15.34 IC3.11 | 13.93,15.23 14.96,16.26 14.96,17.35 | 13.93,15.23 12.07,13.36 10.39,13.36 PS1.2 | 14.96,17.35 14.96,17.63 C1.2 14.96,17.78 14.96,19.91 C3.1 14.96,20.07 14.96,22.2 C5.1 14.96,22.35 14.96,24.49 C4.2 14.96,24.64 14.96,26.77 C7.2 | IC2.11 23.04,28.3 22.99,28.3 21.77,27.08 18.47,27.08 18.16,27.38 IC2.20 18.01,27.38 17.71,27.08 IC2.21 17.55,26.92 15.12,26.92 C7.2 | R11.2 R12.2 10.54,29.51 10.67,29.64 12.03,29.64 D1.C 12.27,29.69 12.88,30.3 14.18,30.3 15.12,29.36 C2.2 14.96,26.92 C7.2 | 14.96,17.35 17.56,17.35 17.56,16.74 IC3.1 | IC5.47 36.3,22.05 37.52,22.05 IC5.48 37.67,22.05 38.89,22.05 IC5.49 39.04,22.05 39.04,23.42 IC5.42 | 36.19,24.82 IC5.44 | IC5.42 38.89,23.42 37.67,23.42 IC5.41 37.52,23.42 36.3,23.42 IC5.46 36.17,24.79 36.3,24.79 36.19,24.82 | 39.04,23.57 39.04,24.79 IC5.43 | 36.19,24.82 IC5.45 | 47.88,22.61 47.88,21.59 C16.2 | 47.88,22.61 47.88,23.57 C15.2 47.73,23.57 v45.11,23.57 39.04,23.57 | C8.2 54.28,19.91 52.15,19.91 C6.2 52,20.07 51.69,20.07 50.93,20.83 50.93,21.89 | J4.10 59.46,23.27 58.96,23.27 57.94,22.25 57.94,21.59 57.64,21.28 55.78,21.28 54.42,22.65 IC4.1 54.28,22.66 52.56,22.66 51.79,21.89 50.93,21.89 | 47.88,22.61 50.22,22.61 50.93,21.89 | 39.04,23.57 IC5.42 | 22.74,11.53 S1.1 22.69,11.2 v21.82,10.34
  Top 0.152: 16.49,13.21 PS1.4 16.46,13.13 v14.81,13.13 | IC6.1 52.44,15.16 51.77,15.16 50.93,14.33 C10.2 50.57,14.3 C9.2 47.93,14.61 C13.2 47.93,17.6 | R4.2 50.4,18.47 50.4,19.05 49.68,19.76 48.49,19.76 47.88,19.15 47.88,18.83 C14.2 47.93,17.6 | J4.MP3 J4.23 | 59.46,15.04 56.87,15.04 J4.MP3 | 59.46,15.04 59.54,15.04 v59.54,13.36 | 59.46,15.04 J4.MP4 | J4.MP3 | 45.37,30.12 45.29,30.12 v45.29,28.09 | C11.2 47.95,30 45.49,30 45.37,30.12 | 45.37,30.12 45.29,30.2 IC5.1 | 59.46,29.06 56.87,29.06 J4.MP1 | 59.46,29.06 59.51,29.06 v59.51,30.73 | 59.46,29.06 J4.MP2 | IC5.40 v45.29,11.66 | 22.74,31.95 S2.1 v21.24,33.32 | v47.2,17.6 47.93,17.6 | 13.93,15.23 11.02,18.14 U$33.GND | J2.A1_B12 7.45,32.51 7.42,32.54 J2.SH1 | J2.B1_A12 7.45,24.03 7.32,23.9 J2.SH2
  Bottom 0.152: 58.55,37.72 58.55,31.7 v59.51,30.73 | v45.11,23.57 45.29,23.75 | 19.23,3.3 U$11.1
  pour Bottom: -0.56,-0.58 64.16,-0.58 64.16,43.26 -0.36,43.26
HREF  (via drill 0.35)
  Top 0.152: v31.96,29.24 33.89,27.3 36.32,27.3 37.67,28.65 37.67,30.58 IC5.7 | v34.7,36.45 50.24,36.45 51.41,35.28 51.41,34.44 52.1,33.76 v54.08,33.76 | v60.99,21.97 60.76,21.74 58.7,21.74 58.37,21.41 58.37,20.9 58.91,20.37 59.46,20.37 J4.16
  Bottom 0.152: v31.96,29.24 31.96,32.03 34.7,34.77 v34.7,36.45 | v54.08,33.76 54.87,33.76 62.21,26.42 62.21,23.19 v60.99,21.97
N$1
  Top 0.152: R1.2 12.07,31.19 D1.A
N$2
  Top 0.152: R12.1 9.32,29.51 7.5,29.51 J2.A5
N$3
  Top 0.152: R11.1 9.32,27.69 8.11,26.47 7.5,26.47 J2.B5
PCLK  (via drill 0.35)
  Top 0.152: C16.1 49.62,21.37 48.77,20.52 35.69,20.52 33.71,22.5 v33.68,22.5 | v31.24,21.89 31.22,21.89 30.61,21.28 IC5.21 | v60.99,24.49 60.78,24.28 59.56,24.28 J4.8
  Bottom 0.152: v31.24,21.89 31.27,21.92 33.1,21.92 v33.68,22.5 33.71,22.5 40.87,29.67 55.81,29.67 v60.99,24.49
RESET
  Top 0.152: R2.2 49.86,29.06 48.03,29.06 C11.1 47.6,28.98 45.93,27.3 43.79,27.3 42.75,28.35 IC5.3 42.78,30.69 42.78,35.53 42.19,36.12 35.49,36.12 35.08,35.71 34.29,35.71 33.68,36.32 32.59,36.32 31.9,35.64 31.9,34.37 31.63,34.09 28.98,34.09 26.85,31.95 26.09,31.95 S2.2
S1
  Top 0.152: IC3.3 18.61,15.66 18.14,15.19 15.57,15.19 12.45,12.06 12.45,9.8 11,8.36 U$13.3
S2
  Top 0.152: U$15.3 13.79,8.33 14.71,8.33 18.11,11.73 18.11,14.3 18.89,15.08 18.93,15.09 IC3.4
S3
  Top 0.152: U$14.3 18.54,10.34 18.54,13.79 19.38,14.63 19.38,14.73 IC3.5
S4
  Top 0.152: IC3.6 19.84,14.27 19.84,14.17 19.38,13.72 19.38,8.48 U$11.3
S5
  Top 0.152: IC3.7 20.45,13.82 20.45,10.16 22.13,8.48 U$12.3
S6
  Top 0.152: IC3.8 21.78,13.83 22.94,12.67 23.27,12.67 23.83,12.12 23.83,9.52 24.87,8.48 U$1.3
S7  (via drill 0.35)
  Top 0.152: v23.19,13.36 22.28,14.27 IC3.9
  Bottom 0.152: v23.19,13.36 27.61,8.94 27.61,8.48 U$2.3
S8
  Top 0.152: IC3.10 22.74,14.73 24.31,13.16 24.31,10.64 25.55,9.4 29.59,9.4 30.51,8.48 U$3.3
S9
  Top 0.152: IC3.12 23.65,15.65 23.65,15.62 24.79,14.48 24.79,10.69 25.78,9.7 32.03,9.7 33.25,8.48 U$4.3
S10
  Top 0.152: U$5.3 34.47,10.01 25.94,10.01 25.3,10.64 25.3,14.88 24.11,16.08 24.11,16.1 IC3.13
S11  (via drill 0.35)
  Top 0.152: IC3.14 25.83,15.25 25.83,14.43 26.47,13.79 v27.49,13.79
  Bottom 0.152: v27.49,13.79 33.48,13.79 U$6.3
S12  (via drill 0.35)
  Top 0.152: v25.78,17.32 25.02,17.32 24.56,17.78 IC3.15
  Bottom 0.152: v25.78,17.32 32.74,17.32 U$7.3
S13  (via drill 0.35)
  Top 0.152: v25.78,18.26 25.35,18.69 24.41,18.69 24.11,18.39 IC3.16
  Bottom 0.152: v25.78,18.26 34.62,18.26 U$8.3
S14  (via drill 0.35)
  Top 0.152: v25.78,19.2 24.01,19.2 23.65,18.85 IC3.17 | v44.55,10.16 44.55,10.13 46.31,8.38 U$9.3
  Bottom 0.152: v25.78,19.2 25.94,19.05 35.66,19.05 v44.55,10.16
S15  (via drill 0.35)
  Top 0.152: v22.35,16.87 22.35,18.47 23.04,19.15 IC3.18 | v27.71,10.9 44.96,10.9 45.93,9.93 48.54,9.93 U$10.3
  Bottom 0.152: v22.35,16.87 22.35,15.98 27.43,10.9 v27.71,10.9
S16  (via drill 0.35)
  Top 0.152: v23.98,20.27 23.24,20.27 22.74,19.76 IC3.19 | v29.72,19.99 32.92,19.99 36.81,16.1 44.38,16.1 46.15,14.33 46.15,11.86 47.6,10.41 50.83,10.41 52.76,8.48 U$16.3
  Bottom 0.152: v29.72,19.99 29.44,20.27 v23.98,20.27
S17  (via drill 0.35)
  Top 0.152: v21.03,25.48 21.03,25.43 22.58,23.88 IC2.3 | v4.3,29.06 4.3,32.36 9.22,37.29 9.22,38.4 9.58,38.76 v51.44,38.76
  Bottom 0.152: v21.03,25.48 19.13,27.38 5.97,27.38 v4.3,29.06 | v51.44,38.76 51.44,36.52 52.86,35.1 U$17.3
S18  (via drill 0.35)
  Top 0.152: v25.83,21.97 25.4,21.97 23.19,24.18 IC2.4 | v32.31,23.55 33.07,24.31 33.07,25.98 v31.55,27.51
  Bottom 0.152: v25.83,21.97 29.7,21.97 31.27,23.55 v32.31,23.55 | v31.55,27.51 31.6,27.51 32.64,28.55 32.64,29.97 37.49,34.82 37.49,35.74 38.25,36.5 47.98,36.5 49.41,35.08 U$18.3
S19  (via drill 0.35)
  Top 0.152: v24.72,23.55 24.72,23.57 23.65,24.64 IC2.5
  Bottom 0.152: v24.72,23.55 25.02,23.85 26.47,23.85 31.27,28.65 31.27,33.73 31.9,34.37 31.9,35.64 32.59,36.32 33.53,36.32 34.72,37.52 34.72,38.18 35.21,38.66 48.03,38.66 48.69,38 48.69,36.96 49.28,36.37 50.68,36.37 51.39,35.66 51.39,34.37 50.8,33.78 48.57,33.78 U$19.3
S20  (via drill 0.35)
  Top 0.152: v25.81,22.89 25.81,23.39 24.11,25.09 IC2.6
  Bottom 0.152: v25.81,22.89 28.25,22.89 35.03,29.67 36.91,29.67 41.25,34.01 43.41,34.01 U$21.3
S21
  Top 0.152: IC2.7 26.14,27.41 26.14,29.11 27.79,30.76 27.79,31.22 28.83,32.26 38.89,32.26 41.63,35 U$20.3
S22  (via drill 0.35)
  Top 0.152: v19.13,26.34 19.18,26.39 23.83,26.39 24.36,26.92 24.41,26.92 IC2.8 | v30.08,32.87 36.68,32.87 U$22.3
  Bottom 0.152: v19.13,26.34 18.39,27.08 5.36,27.08 3.69,28.75 3.69,29.36 3.99,29.67 5.67,29.67 5.82,29.51 18.85,29.51 23.65,34.32 23.65,35.84 24.21,36.4 28.63,36.4 29.29,35.74 29.29,33.65 v30.08,32.87
S23
  Top 0.152: U$23.3 34.5,33.48 29.59,33.48 27.38,31.27 27.38,30.84 24.11,27.56 24.11,27.53 IC2.9
S24
  Top 0.152: IC2.10 23.51,27.9 23.95,28.35 24.31,28.35 26.88,30.91 26.88,31.22 29.44,33.78 32.01,33.78 U$24.3
S25
  Top 0.152: U$25.3 29.52,35.08 28.12,33.68 26.29,33.68 25.33,32.71 25.33,31.55 22.74,28.96 22.74,28.9 IC2.12
S26  (via drill 0.35)
  Top 0.152: v21.03,28.4 21.26,28.4 22.08,29.21 22.13,29.21 IC2.13
  Bottom 0.152: v21.03,28.4 21.03,28.42 27.7,35.09 U$26.3
S27
  Top 0.152: U$27.3 24.92,32.46 22.68,30.23 22.18,30.23 21.7,29.75 IC2.14
S28
  Top 0.152: IC2.15 20.14,29.98 20.14,33.1 U$28.3
S29
  Top 0.152: U$29.3 19.33,29.87 19.84,29.36 IC2.16
S30
  Top 0.152: U$30.3 16.54,31.75 19.31,28.98 IC2.17
S31
  Top 0.152: 18.9,28.47 | 18.9,28.47 13.74,33.63 U$31.3 | 18.9,28.47 IC2.18
S32
  Top 0.152: IC2.19 18.47,27.99 11.38,35.08 U$32.3
SCL  (via drill 0.35)
  Top 0.152: R23.1 16.72,20.6 17.55,20.6 18.27,21.31 18.87,21.31 19.99,20.2 IC3.23 | IC2.23 18.01,25.09 17.96,25.09 17.5,24.64 16.26,24.64 16.03,24.41 16.03,21.28 16.64,20.68 R23.1 | v27.46,12.5 27.94,12.01 41.96,12.01 42.7,12.75 42.7,13.06 IC5.38 | R23.1 v16.69,19.71
  Bottom 0.152: v27.46,12.5 27.61,12.65 20.55,19.71 v16.69,19.71 13.97,19.71 10.48,23.2 U$33.SCL
SDA  (via drill 0.35)
  Top 0.152: R24.1 16.72,23.95 v17.68,23.95 17.73,23.95 IC2.24 | v18.54,20.65 18.6,20.65 IC3.24 | v29.44,14.91 42.67,14.91 44.02,13.56 IC5.39
  Bottom 0.152: v18.54,20.65 18.54,23.09 v17.68,23.95 | v18.54,20.65 15.57,20.65 U$33.SDA | v29.44,14.91 27.05,14.91 21.31,20.65 v18.54,20.65
VCC
  Top 1.016: J1.1 4.4,12.39 U$13.2 U$15.2 U$14.2 U$11.2 U$12.2 U$1.2 U$2.2 U$3.2 U$4.2 U$5.2 U$6.2 U$7.2 44.48,5.82 U$8.2 U$9.2 U$10.2 U$16.2 56.72,9.68 59.39,9.68 62.11,12.39 62.11,31.22 59.51,33.81 56.67,33.81 U$17.2 U$18.2 U$19.2 U$21.2 U$20.2 U$22.2 U$23.2 U$24.2 U$25.2 U$26.2 U$27.2 U$28.2 U$29.2 U$30.2 U$31.2 U$32.2
VCC_1.2V  (via drill 0.35)
  Top 0.152: v53.19,23.34 53.19,23.57 54.17,24.55 IC4.2 | C6.1 52.15,21.13 52.56,21.13 v53.19,21.77 53.24,21.77 54,21.01 C8.1 54.28,20.98 54.43,20.83 56.72,20.83 J4.15
  Bottom 0.152: v53.19,23.34 v53.19,21.77
VCC_2.8V  (via drill 0.35)
  Top 0.152: C9.1 50.58,13.23 C10.1 50.62,13.23 52.44,13.23 IC6.2 52.46,13.23 53.44,13.23 v54.82,11.86 | J4.21 57.03,17.78 58.09,16.71 v58.09,15.65
  Bottom 0.152: v58.09,15.65 58.09,15.14 v54.82,11.86
VCC_3.3V  (via drill 0.35)
  Top 0.152: C2.1 13.9,26.92 C7.1 13.03,26.84 11.81,25.63 11.81,22.02 U$33.VCC 9.22,19.43 9.22,17.55 9.91,16.87 11.58,16.87 12.65,15.8 12.65,14.96 12.02,14.33 8.89,14.33 | PS1.3 9.89,10.91 8.87,11.94 8.87,14.3 8.89,14.33 | 51.21,23.42 49.1,23.42 48.95,23.57 C15.1 48.95,23.72 48.95,25.4 50.88,27.33 50.88,29.11 50.02,29.97 R2.1 49.86,30.12 48.19,31.8 44.83,31.8 44.07,31.04 44.07,30.73 IC5.2 | 51.21,23.42 51.23,23.42 51.23,23.57 | 51.23,23.57 51.39,23.57 IC4.3 51.23,23.57 | R3.2 50.32,15.87 49.28,15.87 49,16.15 C13.1 | 55.2,14.21 IC6.3 | J4.14 59.56,21.28 60.33,21.28 60.94,20.68 v60.94,19.86 | v57.79,13.36 56.21,13.36 55.45,14.12 55.29,14.12 IC6.3 | 51.41,15.85 R3.2 | R3.2 | v51.21,22.55 51.21,23.42 | 8.89,14.33 3.53,14.33 3.03,13.82 3.03,12.22 10.67,4.57 v54.59,4.57 | R6.2 R5.2 | R6.2 53.06,16.71 52.2,15.85 51.41,15.85 | R6.2 | 51.41,15.85 v51.41,15.93 | R6.2 53.7,16.61 55.2,15.11 55.2,14.27 IC6.3
  Bottom 0.152: v60.94,19.86 59.87,18.8 59.87,15.44 v57.79,13.36 54.59,10.16 v54.59,4.57 | v51.21,22.55 51.18,22.53 51.18,16.15 v51.41,15.93
VCC_5V  (via drill 0.35)
  Top 0.152: IC3.25 | IC3.25 18.7,19.63 17.53,19.63 v16.39,18.49 | v13.9,16.54 13.9,17.63 C1.1 13.9,17.78 13.9,19.91 C3.2 13.9,20.07 13.9,22.2 C5.2 13.9,22.35 13.9,24.49 C4.1 13.89,24.83 13.02,25.7 v12.85,25.7 | IC2.26 19.38,23.88 19.08,24.18 IC2.25 17.81,23.11 16.79,23.11 R24.2 R23.2 16.72,21.67 v17.66,21.67 | R1.1 9.45,32.56 8.51,33.5 6.15,33.5 4.9,32.26 4.9,20.5 9.89,15.51 PS1.1 10.39,15.49 v11.92,15.49 | R1.1 | R1.1 8.97,31.19 8.39,30.62 J2.A4_B9 7,30.62 5.46,29.08 5.46,27.38 7.03,25.82 J2.B4_A9
  Bottom 0.152: v16.39,18.49 14.43,16.54 v13.9,16.54 12.96,16.54 v11.92,15.49 | v17.66,21.67 13.62,25.7 v12.85,25.7
VSYNC  (via drill 0.35)
  Top 0.152: J4.18 60.4,19.28 v60.94,18.74 | v52.66,26.44 50.93,26.44 v49.74,25.25 | v45.9,25.6 45.39,25.09 41.38,25.09 39.04,27.43 39.04,30.58 IC5.6
  Bottom 0.152: v60.94,18.74 61.67,19.48 61.67,20.4 61.17,20.9 59.97,20.9 57.53,23.34 57.53,24.08 57.94,24.49 58.4,24.49 58.8,24.89 58.8,25.53 58.52,25.81 53.29,25.81 v52.66,26.44 | v49.74,25.25 46.26,25.25 v45.9,25.6
XCLK  (via drill 0.35)
  Top 0.152: v60.99,23.11 60.23,22.35 59.62,22.35 J4.12 | v56.92,30.4 53.6,30.4 v53.27,30.73 | IC5.8 v36.4,28.7
  Bottom 0.152: v60.99,23.11 61.9,24.03 61.9,25.45 56.95,30.4 v56.92,30.4 | v53.27,30.73 41.48,30.73 35.23,24.49 32.06,24.49 31.7,24.84 31.7,25.37 35.03,28.7 v36.4,28.7

### Text on the board
text: 32 | 31 | 30 | 29 | 28 | 27 | 26 | 25 | 24 | 23 | 22 | 21 | 20 | 19 | 18 | 17 | - | - | + | + | S | S | USB-C | POWER | RESET | (c) Endurance R/C LLC | ● | GND | CAMERA | ● | BOOT | 32 Servo Controller v1.0 | www.endurance-rc.com | +5V | S | S | + | + | - | - | 1 | 2 | 3 | 4 | 5 | 6 | 7 | 8 | 9 | 10 | 11 | 12 | 13 | 14 | 15 | 16